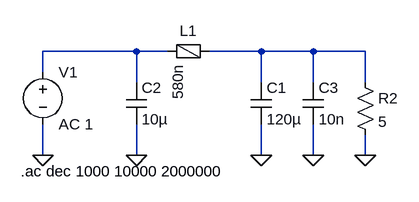
[diagram p0: schematic input_filter_with_ferrite.asc]
input_filter_with_ferrite.asc, the LTspice schematic file:
Version 4
SHEET 1 880 680
WIRE 144 64 0 64
WIRE 192 64 144 64
WIRE 336 64 256 64
WIRE 416 64 336 64
WIRE 496 64 416 64
WIRE 0 96 0 64
WIRE 144 112 144 64
WIRE 336 112 336 64
WIRE 416 112 416 64
WIRE 496 112 496 64
WIRE 0 224 0 176
WIRE 144 224 144 176
WIRE 336 224 336 176
WIRE 416 224 416 176
WIRE 496 224 496 192
FLAG 336 224 0
FLAG 496 224 0
FLAG 0 224 0
FLAG 144 224 0
FLAG 416 224 0
SYMBOL cap 320 112 R0
SYMATTR InstName C1
SYMATTR Value 120µ
SYMATTR SpiceLine V=35 Irms=0 Rser=0 Lser=0 mfg="Murata" pn="GRM21BR6YA106KE43" type="X5R"
SYMBOL res 480 96 R0
SYMATTR InstName R2
SYMATTR Value 5
SYMBOL voltage 0 80 R0
WINDOW 123 0 0 Left 0
WINDOW 39 0 0 Left 0
SYMATTR InstName V1
SYMATTR Value AC 1
SYMBOL cap 128 112 R0
SYMATTR InstName C2
SYMATTR Value 10µ
SYMBOL cap 400 112 R0
SYMATTR InstName C3
SYMATTR Value 10n
SYMBOL FerriteBead 224 64 R90
WINDOW 0 -16 0 VBottom 2
SYMATTR InstName L1
SYMATTR Value 580n
SYMATTR SpiceLine Ipk=3 Rser=0.0032 Rpar=105 Cpar=10f mfg="Würth Elektronik" pn="74276051 WE-WAFB 7835"
TEXT -34 248 Left 2 !.ac dec 1000 10000 2000000

The netlist it stands for:
* input_filter_with_ferrite.asc
C1 N002 0 120µ V=35 Irms=0 Rser=0 Lser=0 mfg="Murata" pn="GRM21BR6YA106KE43" type="X5R"
R2 N002 0 5
V1 N001 0 AC 1
C2 N001 0 10µ
C3 N002 0 10n
L1 N002 N001 580n Ipk=3 Rser=0.0032 Rpar=105 Cpar=10f mfg="Würth Elektronik" pn="74276051 WE-WAFB 7835"
.ac dec 1000 10000 2000000
.backanno
.end